# EAGLE design ATtiny_45_and_85_programmer_shield (EAGLE 6.1)
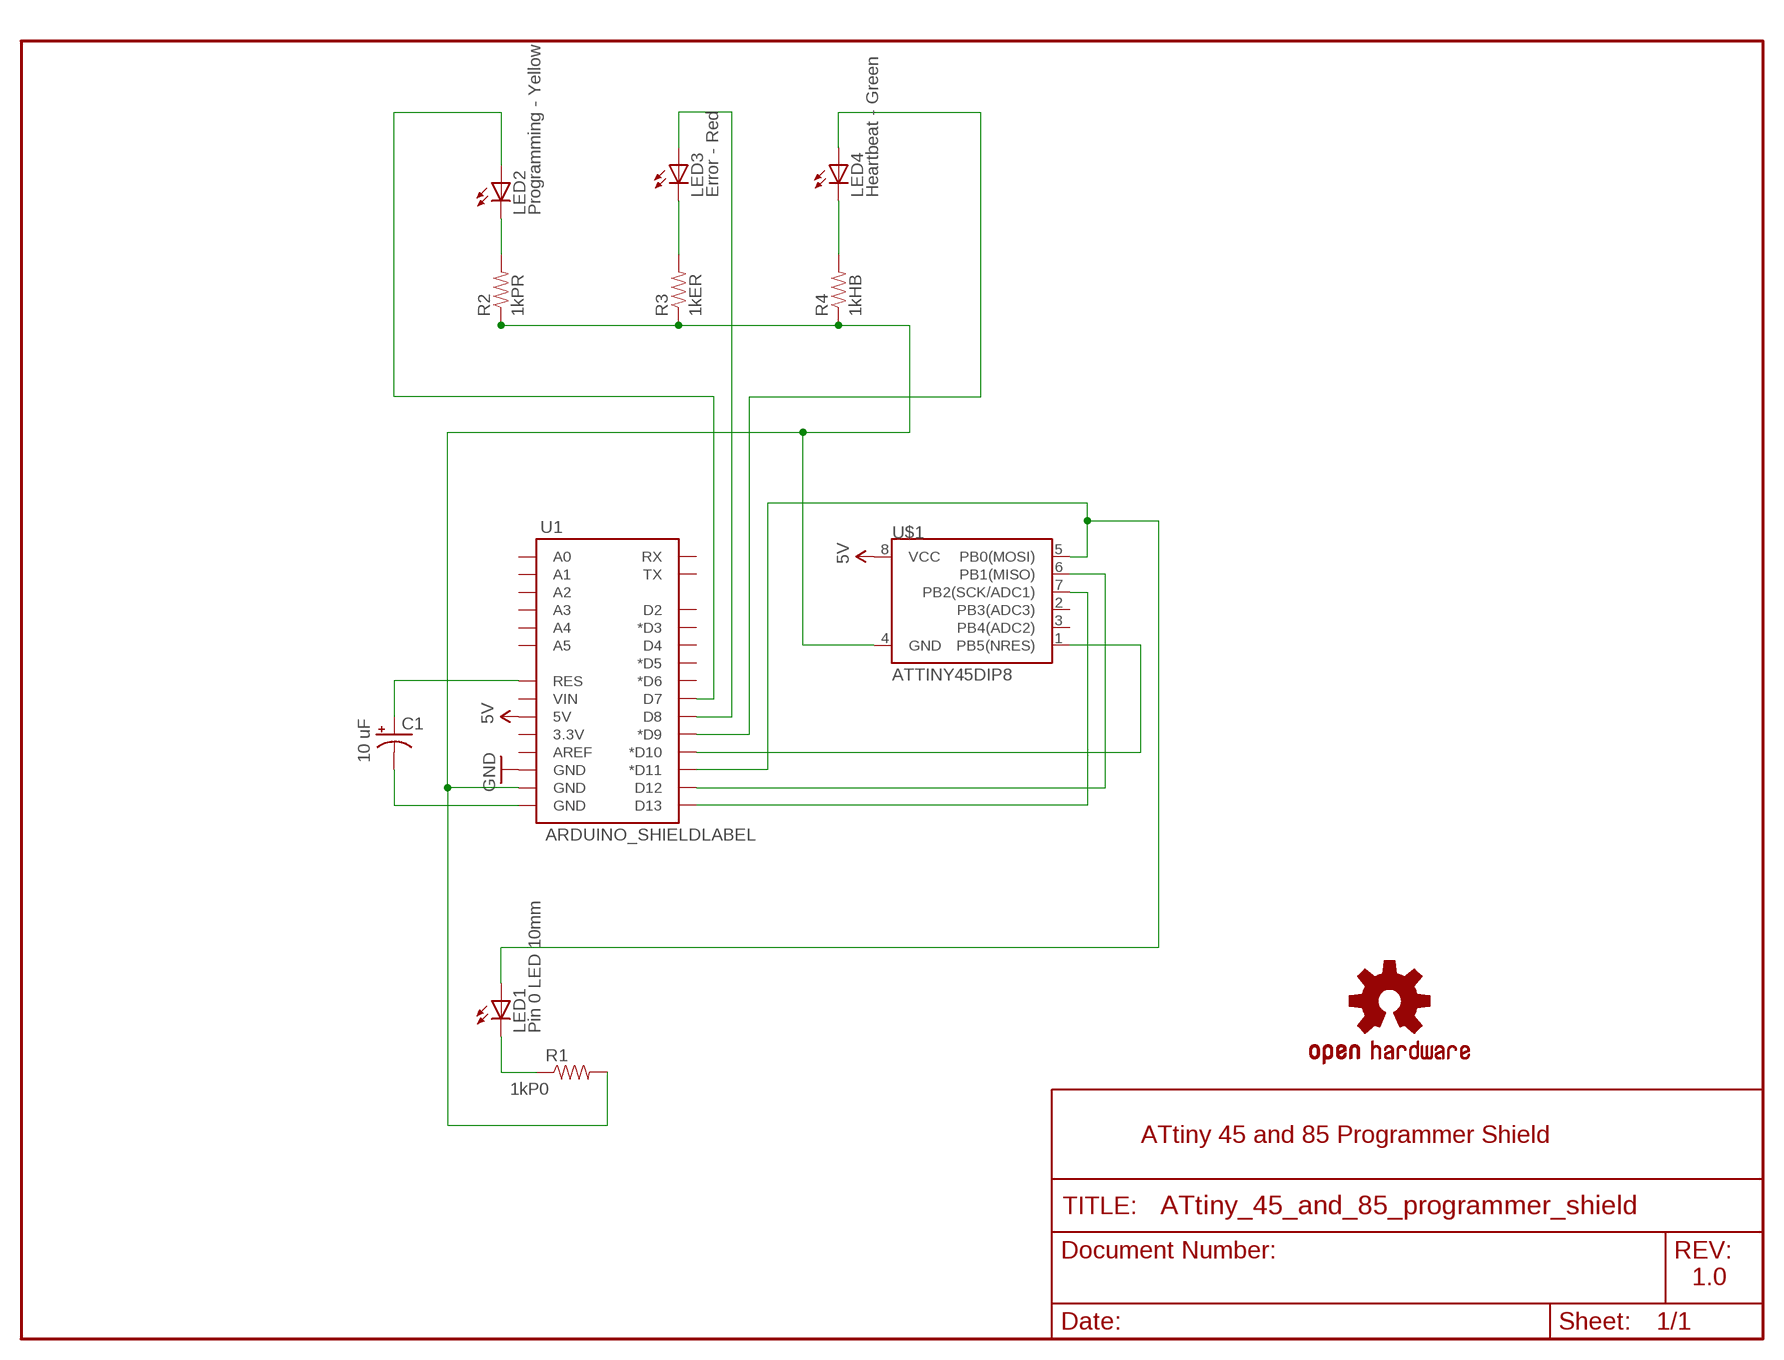
[diagram p0: schematic, sheet 1]

## Parts
C1  10 uF  CAP_POLPTH2  [CPOL-RADIAL-10UF-25V]
LED1  Pin 0 LED 10mm  LED10MM  [LED10MM]
LED2  Programming - Yellow  LED5MM  [LED5MM]
LED3  Error - Red  LED5MM  [LED5MM]
LED4  Heartbeat - Green  LED5MM  [LED5MM]
R1  1kP0  RESISTORPTH-1/6W  [1/6W-RES]
R2  1kPR  RESISTORPTH-1/6W  [1/6W-RES]
R3  1kER  RESISTORPTH-1/6W  [1/6W-RES]
R4  1kHB  RESISTORPTH-1/6W  [1/6W-RES]
U1  ARDUINO_SHIELDLABEL  [DUEMILANOVE_SHIELD]
U$1  ATTINY45DIP8  [DIP08]
U$4  OSHW-LOGOL  [OSHW-LOGO-L]

## Nets
5V: U1.5V U$1.8(VCC)
GND: U1.GND@2(GND)
N$1: LED1.A U1.D11(*D11) U$1.5(PB0(MOSI))
N$2: U1.D12 U$1.6(PB1(MISO))
N$3: U1.D13 U$1.7(PB2(SCK/ADC1))
N$4: C1.2(-) U1.GND@0(GND)
N$5: C1.1(+) U1.RES
N$6: LED4.A U1.D9(*D9)
N$7: LED1.C R1.1
N$8: LED3.A U1.D8
N$9: LED2.A U1.D7
N$10: R1.2 R2.1 R3.1 R4.1 U1.GND@1(GND) U$1.4(GND)
N$12: LED3.K(C) R3.2
N$13: LED2.K(C) R2.2
N$14: LED4.K(C) R4.2
N$15: U1.D10(*D10) U$1.1(PB5(NRES))
Unconnected: U1.3.3V U1.A0 U1.A1 U1.A2 U1.A3 U1.A4 U1.A5 U1.AREF U1.D2 U1.D3(*D3) U1.D4 U1.D5(*D5) U1.D6(*D6) U1.RX U1.TX U1.VIN U$1.2(PB3(ADC3)) U$1.3(PB4(ADC2))

## Notes on the sheet
- ATtiny 45 and 85 Programmer Shield
- 1.0

## Library data of the parts
C1 = SparkFun:CAP_POL: Capacitor Polarized These are standard SMD and PTH capacitors. Normally 10uF, 47uF, and 100uF in electrolytic and tantalum varieties. Always verify the external diameter of the through hole cap, it varies with capacity, voltage, and manufacturer. The EIA devices should be standard.
LED1-LED4 = SparkFun:LED: LEDs Standard schematic elements and footprints for 5mm, 3mm, 1206, and 0603 sized LEDs. 5mm - Spark Fun Electronics SKU : COM-00529 (and others)
R1-R4 = SparkFun:RESISTOR: Resistor Basic schematic elements and footprints for 0603, 1206, and PTH resistors.
U1 = SparkFun:ARDUINO_SHIELD
U$1 = SparkFun:ATTINY45: Atmel ATTiny45
U$4 = SparkFun:OSHW-LOGO: Open Source Hardware Logo This logo indicates the piece of hardware it is found on incorporates a OSHW license and/or adheres to the definition of open source hardware found here: http://freedomdefined.org/OSHW

## Board
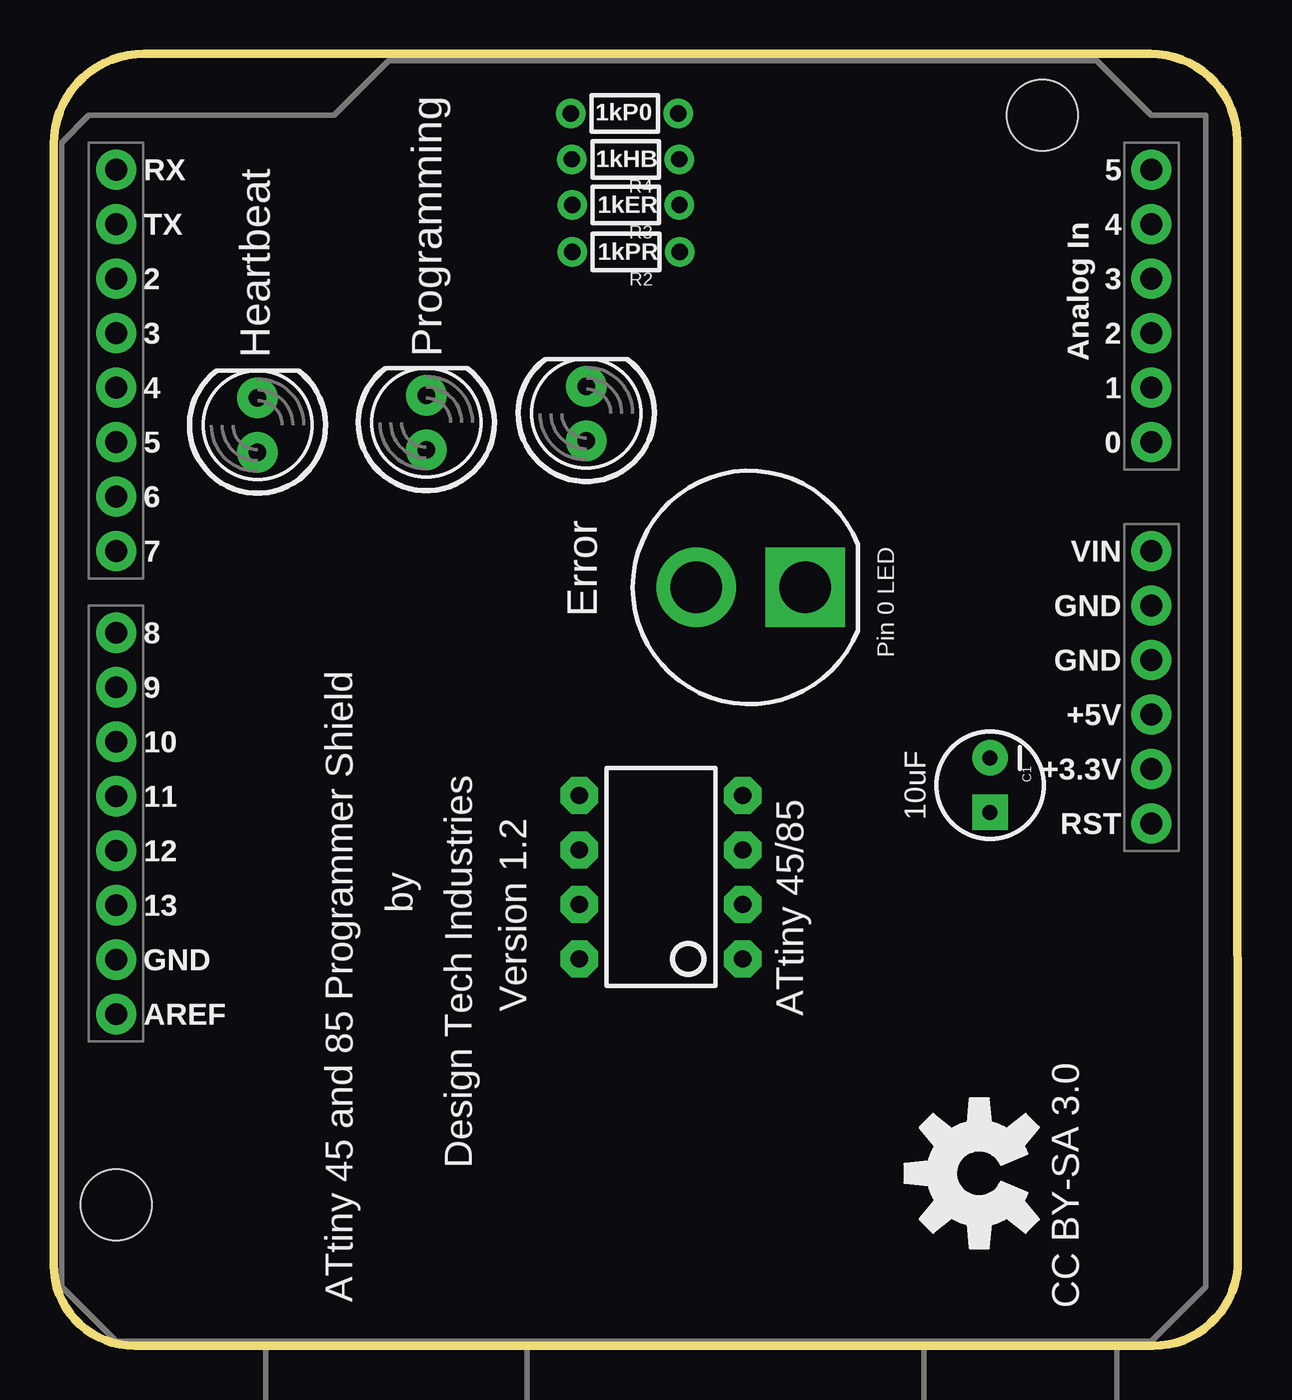
[diagram p1: board, top side]
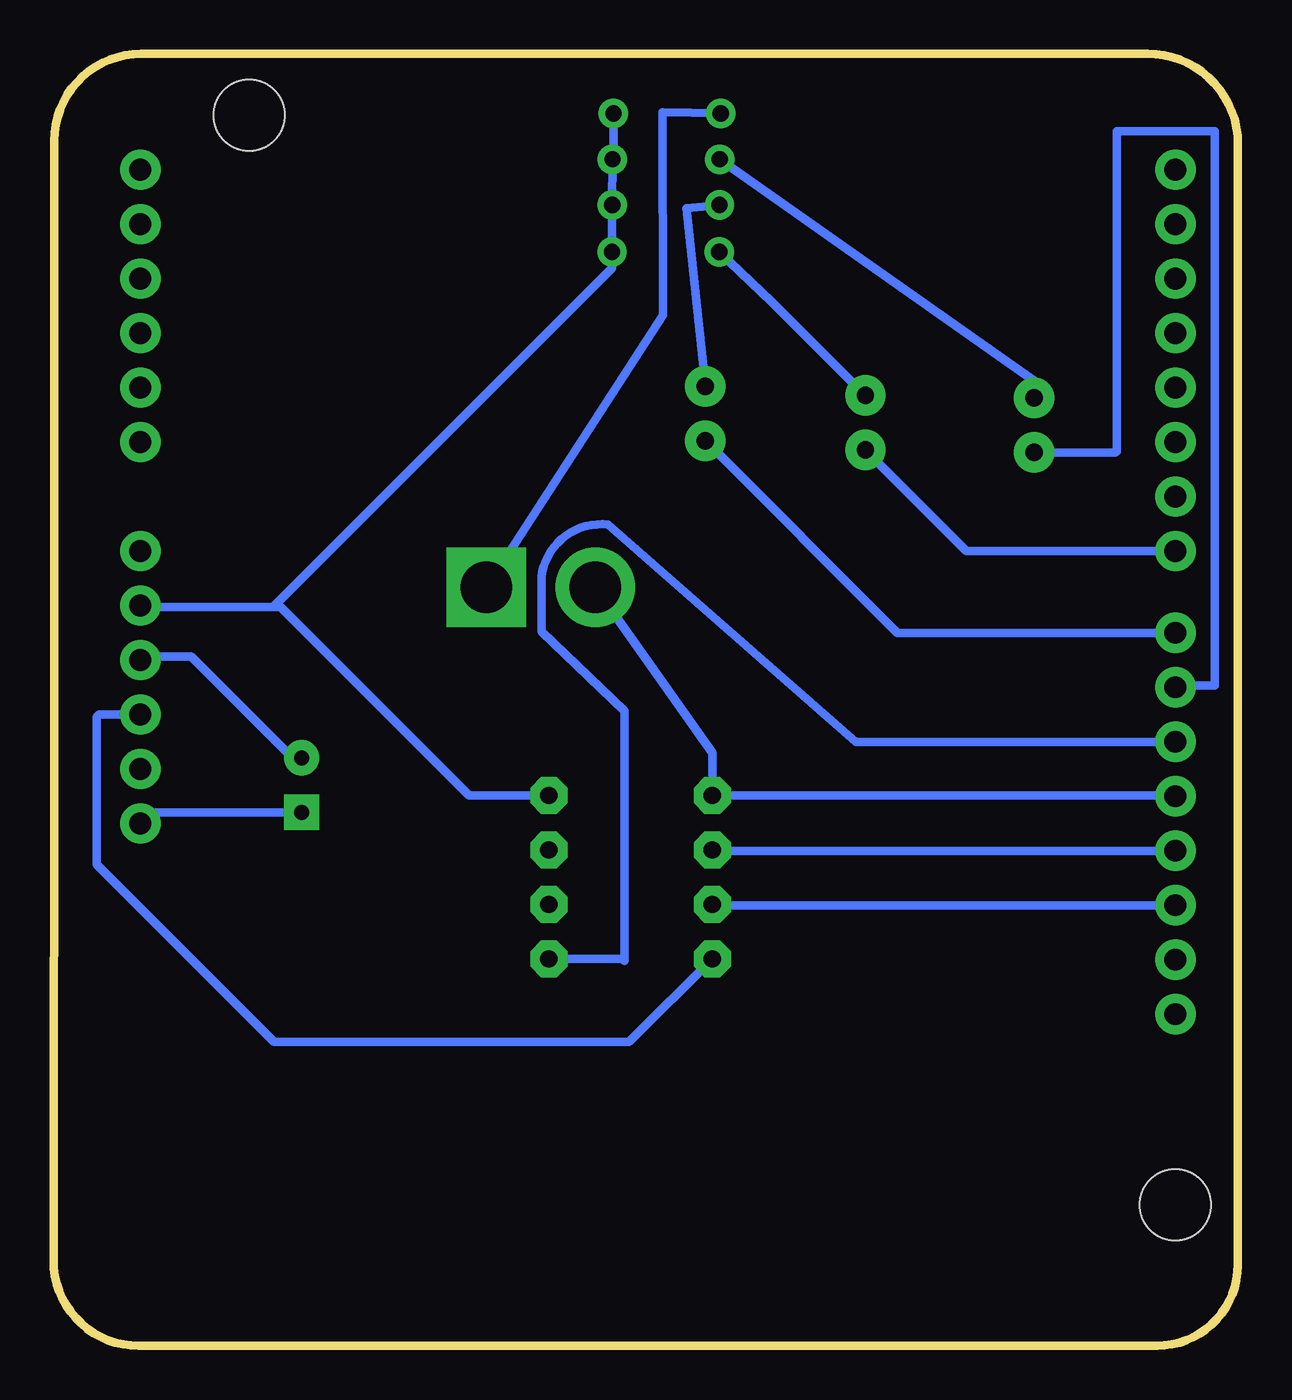
[diagram p2: board, bottom side, seen from below]

Size 55.22 x 60.25 mm. Coordinates in mm from the lower left corner, seen from the top.
Outline: 0.01,30.92 0.01,3.77 arc90 3.78,0 28.22,0
Outline: 0,30.92 0,56.02 arc-90 4.23,60.25 27.17,60.25
Outline: 55.18,32.23 55.18,56.19 arc90 51.13,60.24 27.25,60.24
Outline: 55.19,32.3 55.22,3.99 arc-90 51.25,0 28.2,0
Copper layers (1*16): Top 0.035mm / dielectric 1.5mm / Bottom 0.035mm
Design rules: minimum track width 8mil, minimum drill 20mil, track to track 8mil, track to pad 8mil, pad to pad 8mil, via to via 8mil, smd to smd 8mil, copper to edge 10mil, drill to drill 8mil, minimum pad ring 12mil, minimum via ring 10mil, stop-mask expansion 4mil, vias tented up to drill 25mil, thermal gap 10mil

### Footprints (pad centres in the part's own frame; a part is rotated, then mirrored left to right if it is on the bottom)
CPOL-RADIAL-10UF-25V = drill 0.7 pad 1.651 square: 1 1.27,0 | drill 0.7 pad 1.651: 2 -1.27,0
LED10MM = drill 2.4 pad 3.7: A 2.54,0 | drill 2.4 pad 3.7 square: C -2.54,0
LED5MM = drill 0.813 pad 1.88: A -1.27,0; K 1.27,0
1/6W-RES = drill 0.762: 1 -2.5,0; 2 2.5,0
DUEMILANOVE_SHIELD = drill 1.016 pad 1.88: 3.3V 50.8,26.67; 5V 50.8,29.21; A0 50.8,41.91; A1 50.8,44.45; A2 50.8,46.99; A3 50.8,49.53; A4 50.8,52.07; A5 50.8,54.61; AREF 2.54,15.24; D2 2.54,49.53; D3 2.54,46.99; D4 2.54,44.45; D5 2.54,41.91; D6 2.54,39.37; D7 2.54,36.83; D8 2.54,33.02; D9 2.54,30.48; D10 2.54,27.94; D11 2.54,25.4; D12 2.54,22.86; D13 2.54,20.32; GND@0 50.8,31.75; GND@1 50.8,34.29; GND@2 2.54,17.78; RES 50.8,24.13; RX 2.54,54.61; TX 2.54,52.07; VIN 50.8,36.83 | hole 3.302: 45.72,57.15; 2.54,6.35
DIP08 = drill 0.813 pad 1.727 octagon: 1 -3.81,-3.81; 2 -1.27,-3.81; 3 1.27,-3.81; 4 3.81,-3.81; 5 3.81,3.81; 6 1.27,3.81; 7 -1.27,3.81; 8 -3.81,3.81

### Placement (x,y rotation side)
C1  43.66,26.14 270 top
LED1  32.5,35.36 180 top
LED2  17.37,43.04 90 top
LED3  24.84,43.47 90 top
LED4  9.51,42.92 90 top
R1  26.62,57.46 0 top
R2  26.69,51 180 top
R3  26.68,53.19 180 top
R4  26.67,55.32 180 top
U1  0.38,0.22 0 top
U$1  28.32,21.85 90 top
U$4  43.15,8.04 90 top

### Tracks (layer width: path | path; a pad name or v marks a point on that pad's centre or on a via)
5V
  Bottom 0.406: U1.5V 53.1,29.43 53.22,29.32 53.22,22.44 44.94,14.17 28.38,14.17 U$1.8
N$1
  Bottom 0.406: LED1.A 24.51,27.65 U$1.5 2.95,25.66 U1.D11
N$2
  Bottom 0.406: U1.D12 24.47,23.08 U$1.6
N$3
  Bottom 0.406: U1.D13 24.47,20.54 U$1.7
N$4
  Bottom 0.406: C1.2 44.08,27.41 48.81,32.14 51.02,32.14 U1.GND@0
N$5
  Bottom 0.406: C1.1 50.66,24.87 U1.RES
N$6
  Bottom 0.406: LED4.A 5.72,41.65 5.72,41.7 5.65,41.7 5.65,56.63 1.09,56.63 1.09,30.78 2.92,30.78 U1.D9
N$7
  Bottom 0.406: R1.1 26.84,57.52 26.81,48.05 LED1.C
N$8
  Bottom 0.406: U1.D8 15.88,33.24 LED3.A
N$9
  Bottom 0.406: U1.D7 12.65,37.05 LED2.A
N$10
  Bottom 0.406: U$1.4 35.86,25.66 44.64,34.44 44.98,34.44 | 44.98,34.44 51.1,34.44 U1.GND@1 | R1.2 29.12,55.37 R4.1 R3.1 29.18,51 R2.1 29.19,50.23 44.98,34.44
N$12
  Bottom 0.406: R3.2 25.71,53.03 LED3.K
N$13
  Bottom 0.406: R2.2 21.75,48.69 LED2.K
N$14
  Bottom 0.406: LED4.K 9.51,45 R4.2
N$15
  Bottom 0.406: U$1.1 28.69,18.04 28.59,17.94 28.59,29.61 32.48,33.3 32.48,35.82 arc90 29.36,38.29 17.81,28.16 U1.D10

### Text on the board
tPlace: Heartbeat | Programming | Error | Pin 0 LED | 10uF | by | Version 1.2 | ATtiny 45/85 | Design Tech Industries | ATtiny 45 and 85 Programmer Shield | CC BY-SA 3.0